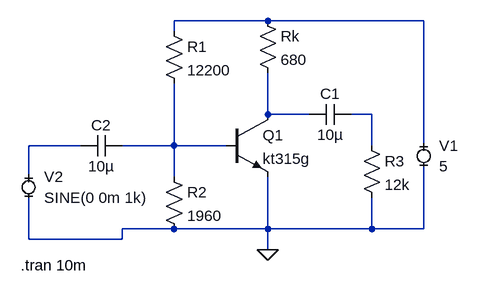
[diagram p0: schematic c[tvf.asc]
c[tvf.asc, the LTspice schematic file:
Version 4
SHEET 1 880 680
WIRE 176 -64 32 -64
WIRE 416 -64 176 -64
WIRE 32 -48 32 -64
WIRE 176 80 176 16
WIRE 240 80 176 80
WIRE 336 80 304 80
WIRE -112 128 -192 128
WIRE 32 128 32 32
WIRE 32 128 -48 128
WIRE 112 128 32 128
WIRE 336 128 336 80
WIRE 416 128 416 -64
WIRE -192 176 -192 128
WIRE 32 176 32 128
WIRE 32 256 -48 256
WIRE 176 256 176 176
WIRE 176 256 32 256
WIRE 336 256 336 208
WIRE 336 256 176 256
WIRE 416 256 416 160
WIRE 416 256 336 256
WIRE -192 272 -192 208
WIRE -48 272 -48 256
WIRE -48 272 -192 272
WIRE 176 288 176 256
FLAG 176 288 0
SYMBOL npn 112 80 R0
SYMATTR InstName Q1
SYMATTR Value kt315g
SYMBOL MiniSyms4\\voltage- 416 144 R0
WINDOW 123 0 0 Left 2
WINDOW 39 0 0 Left 2
SYMATTR InstName V1
SYMATTR Value 5
SYMBOL MiniSyms4\\voltage- -192 192 R0
WINDOW 123 0 0 Left 2
WINDOW 39 0 0 Left 2
SYMATTR InstName V2
SYMATTR Value SINE(0 0m 1k)
SYMBOL res 160 -80 R0
SYMATTR InstName Rk
SYMATTR Value 680
SYMBOL res 16 -64 R0
SYMATTR InstName R1
SYMATTR Value 12200
SYMBOL res 16 160 R0
SYMATTR InstName R2
SYMATTR Value 1960
SYMBOL cap 304 64 R90
WINDOW 0 0 32 VBottom 2
WINDOW 3 32 32 VTop 2
SYMATTR InstName C1
SYMATTR Value 10µ
SYMBOL cap -48 112 R90
WINDOW 0 0 32 VBottom 2
WINDOW 3 32 32 VTop 2
SYMATTR InstName C2
SYMATTR Value 10µ
SYMBOL res 320 112 R0
SYMATTR InstName R3
SYMATTR Value 12k
TEXT -204 312 Left 2 !.tran 10m

The netlist it stands for:
* c[tvf.asc
Q1 N002 N005 0 0 kt315g
V1 N001 0 5
V2 N004 0 SINE(0 0m 1k)
Rk N001 N002 680
R1 N001 N005 12200
R2 N005 0 1960
C1 N003 N002 10µ
C2 N005 N004 10µ
R3 N003 0 12k
.model NPN NPN
.model PNP PNP
.lib standard.bjt
.tran 10m
.backanno
.end